# EAGLE schematic 602_stmotor (EAGLE 7.3.0)
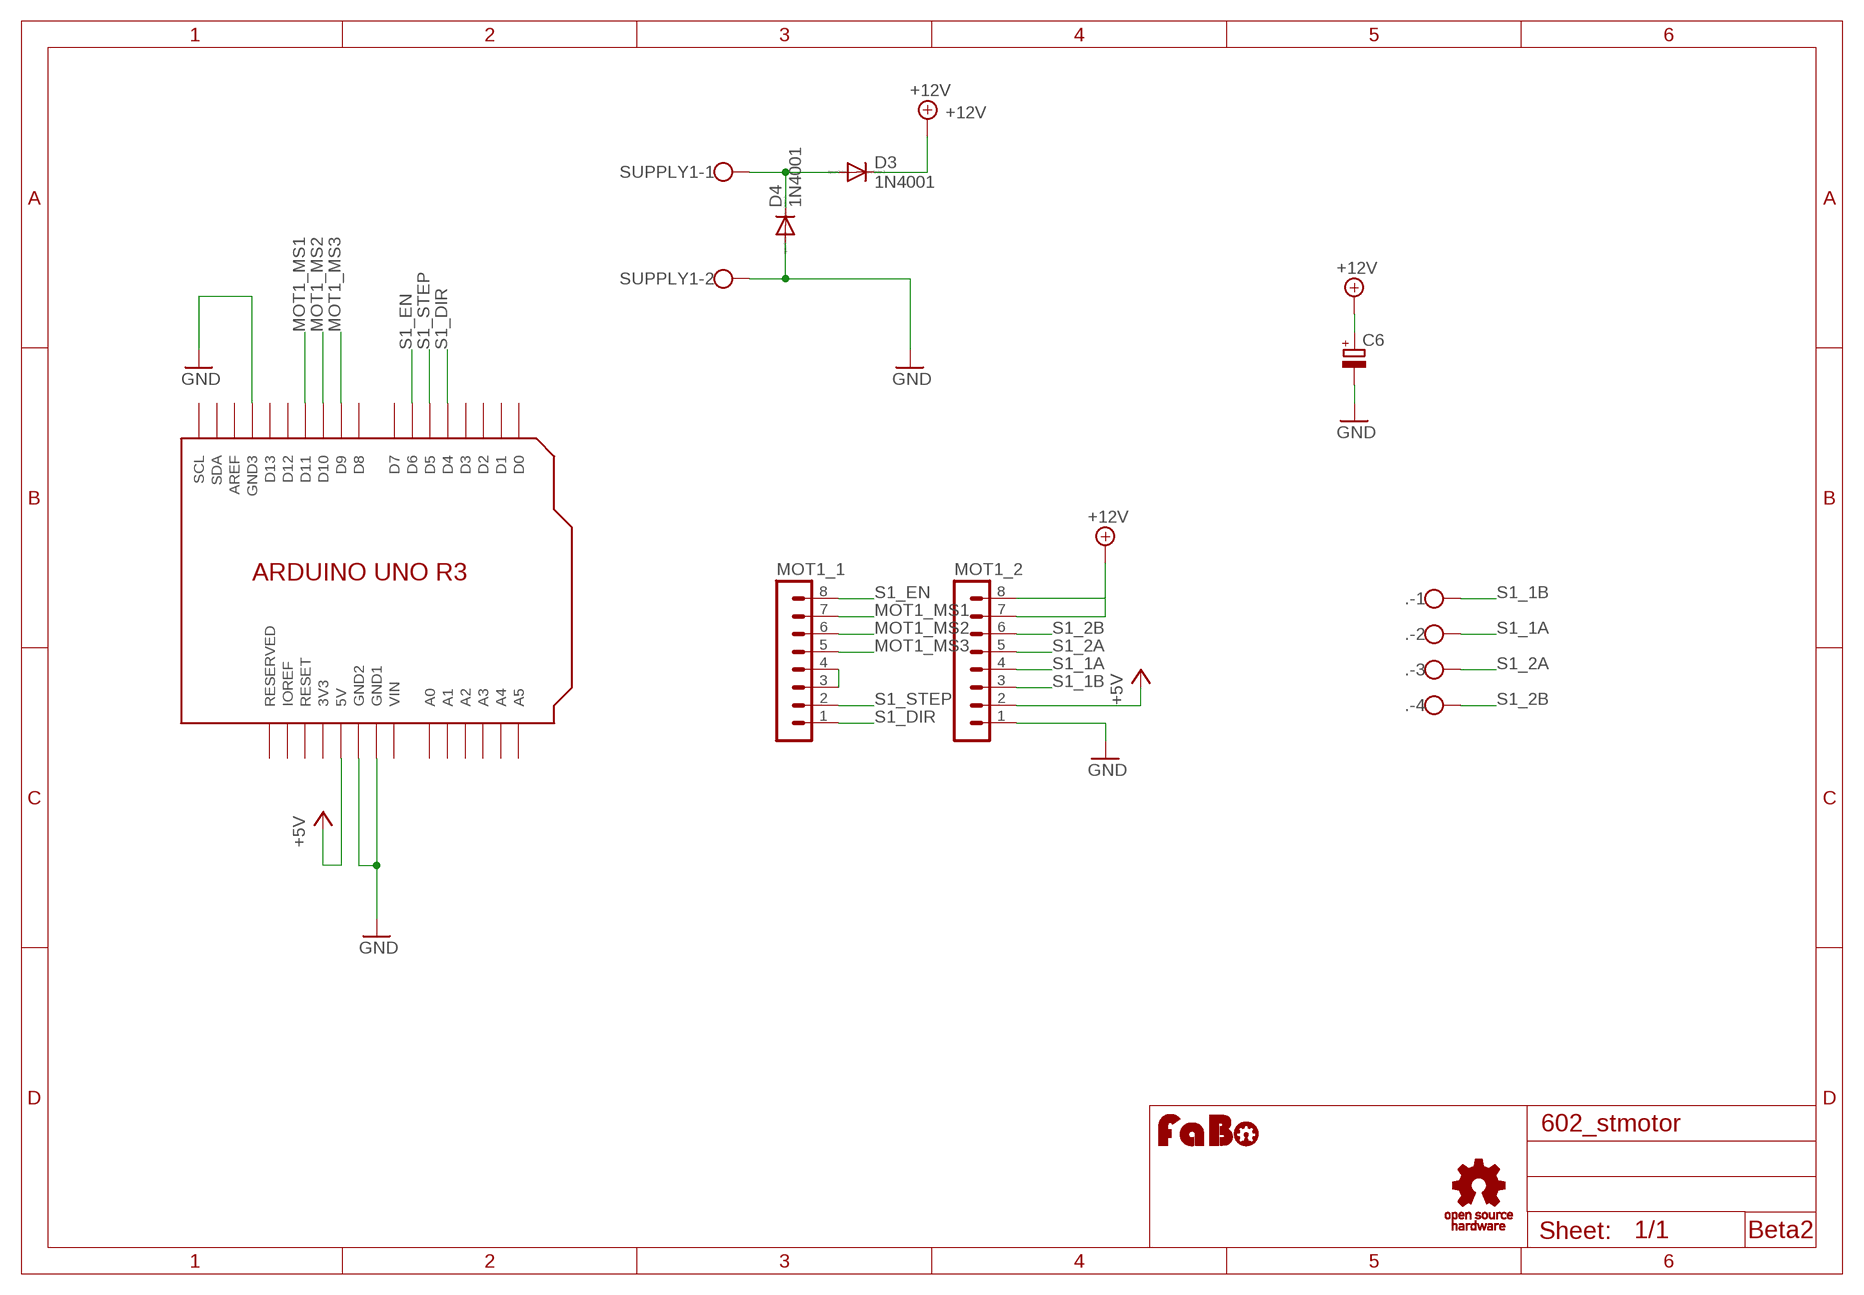
[diagram p0: schematic, sheet 1]

## Parts
.  W237-4  [W237-4]
C6  CPOL-EU153CLV-0807  [153CLV-0807]
D3  1N4001  1N4004  [DO41-10]
D4  1N4001  1N4004  [DO41-10]
MOT1_1  MA08-1  [MA08-1]
MOT1_2  MA08-1  [MA08-1]
SUPPLY1  W237-102  [W237-102]
U1  ARDUINO_UNO_R3_SHIELD  [ARDUINO_UNO_R3]
U$1  LOGO_FABO-M  [LOGO_FABO_M]
U$2  LOGO_OSHW_T-M  [LOGO_OSHW_T_M]

## Nets
+5V: MOT1_2.2 U1.5V
+12V [+12V]: C6.+ D3.C MOT1_2.7
GND: C6.- D4.A MOT1_2.1 SUPPLY1.2 U1.GND1 U1.GND2 U1.GND3
MOT1_MS1: MOT1_1.7 U1.D11
MOT1_MS2: MOT1_1.6 U1.D10
MOT1_MS3: MOT1_1.5 U1.D9
N$1 [+12V]: D3.A D4.C SUPPLY1.1
N$2: MOT1_2.8
S1_1A [+12V]: ..2 MOT1_2.4
S1_1B [+12V]: ..1 MOT1_2.3
S1_2A [+12V]: ..3 MOT1_2.5
S1_2B [+12V]: ..4 MOT1_2.6
S1_DIR: MOT1_1.1 U1.D4
S1_EN: MOT1_1.8 U1.D6
S1_RST: MOT1_1.3 MOT1_1.4
S1_STEP: MOT1_1.2 U1.D5
Unconnected: U1.A0 U1.A1 U1.A2 U1.A3 U1.A4 U1.A5 U1.AREF U1.D0 U1.D1 U1.D2 U1.D3 U1.D7 U1.D8 U1.D12 U1.D13 U1.IOREF U1.RESERVED U1.RESET U1.SCL U1.SDA

## Notes on the sheet
- Beta2

## Power pins joined to a net without a drawn wire
3V3: U1.3V3
VIN: U1.VIN

## Library data of the parts
. = con-wago-500:W237-4: WAGO SCREW CLAMP; OC_FARNELL: unknown; OC_NEWARK: unknown
C6 = rcl:CPOL-EU: POLARIZED CAPACITOR, European symbol
D3 D4 = diode:1N4004: DIODE general purpose rectifier, 1 A
MOT1_1 MOT1_2 = con-lstb:MA08-1: PIN HEADER; OC_FARNELL: unknown; OC_NEWARK: unknown
SUPPLY1 = con-wago-500:W237-102: WAGO SCREW CLAMP; MPN: 237-102; OC_FARNELL: unknown; OC_NEWARK: 70K9898
U1 = GClue:ARDUINO_UNO_R3_SHIELD
U$1 = FaBo:LOGO_FABO
U$2 = GClue:LOGO_OSHW_T

## Net classes
0 default: width 0.406 mm
1 +12V: width 1.016 mm